# EAGLE design dragon_fractal_pcb (EAGLE 6.1)
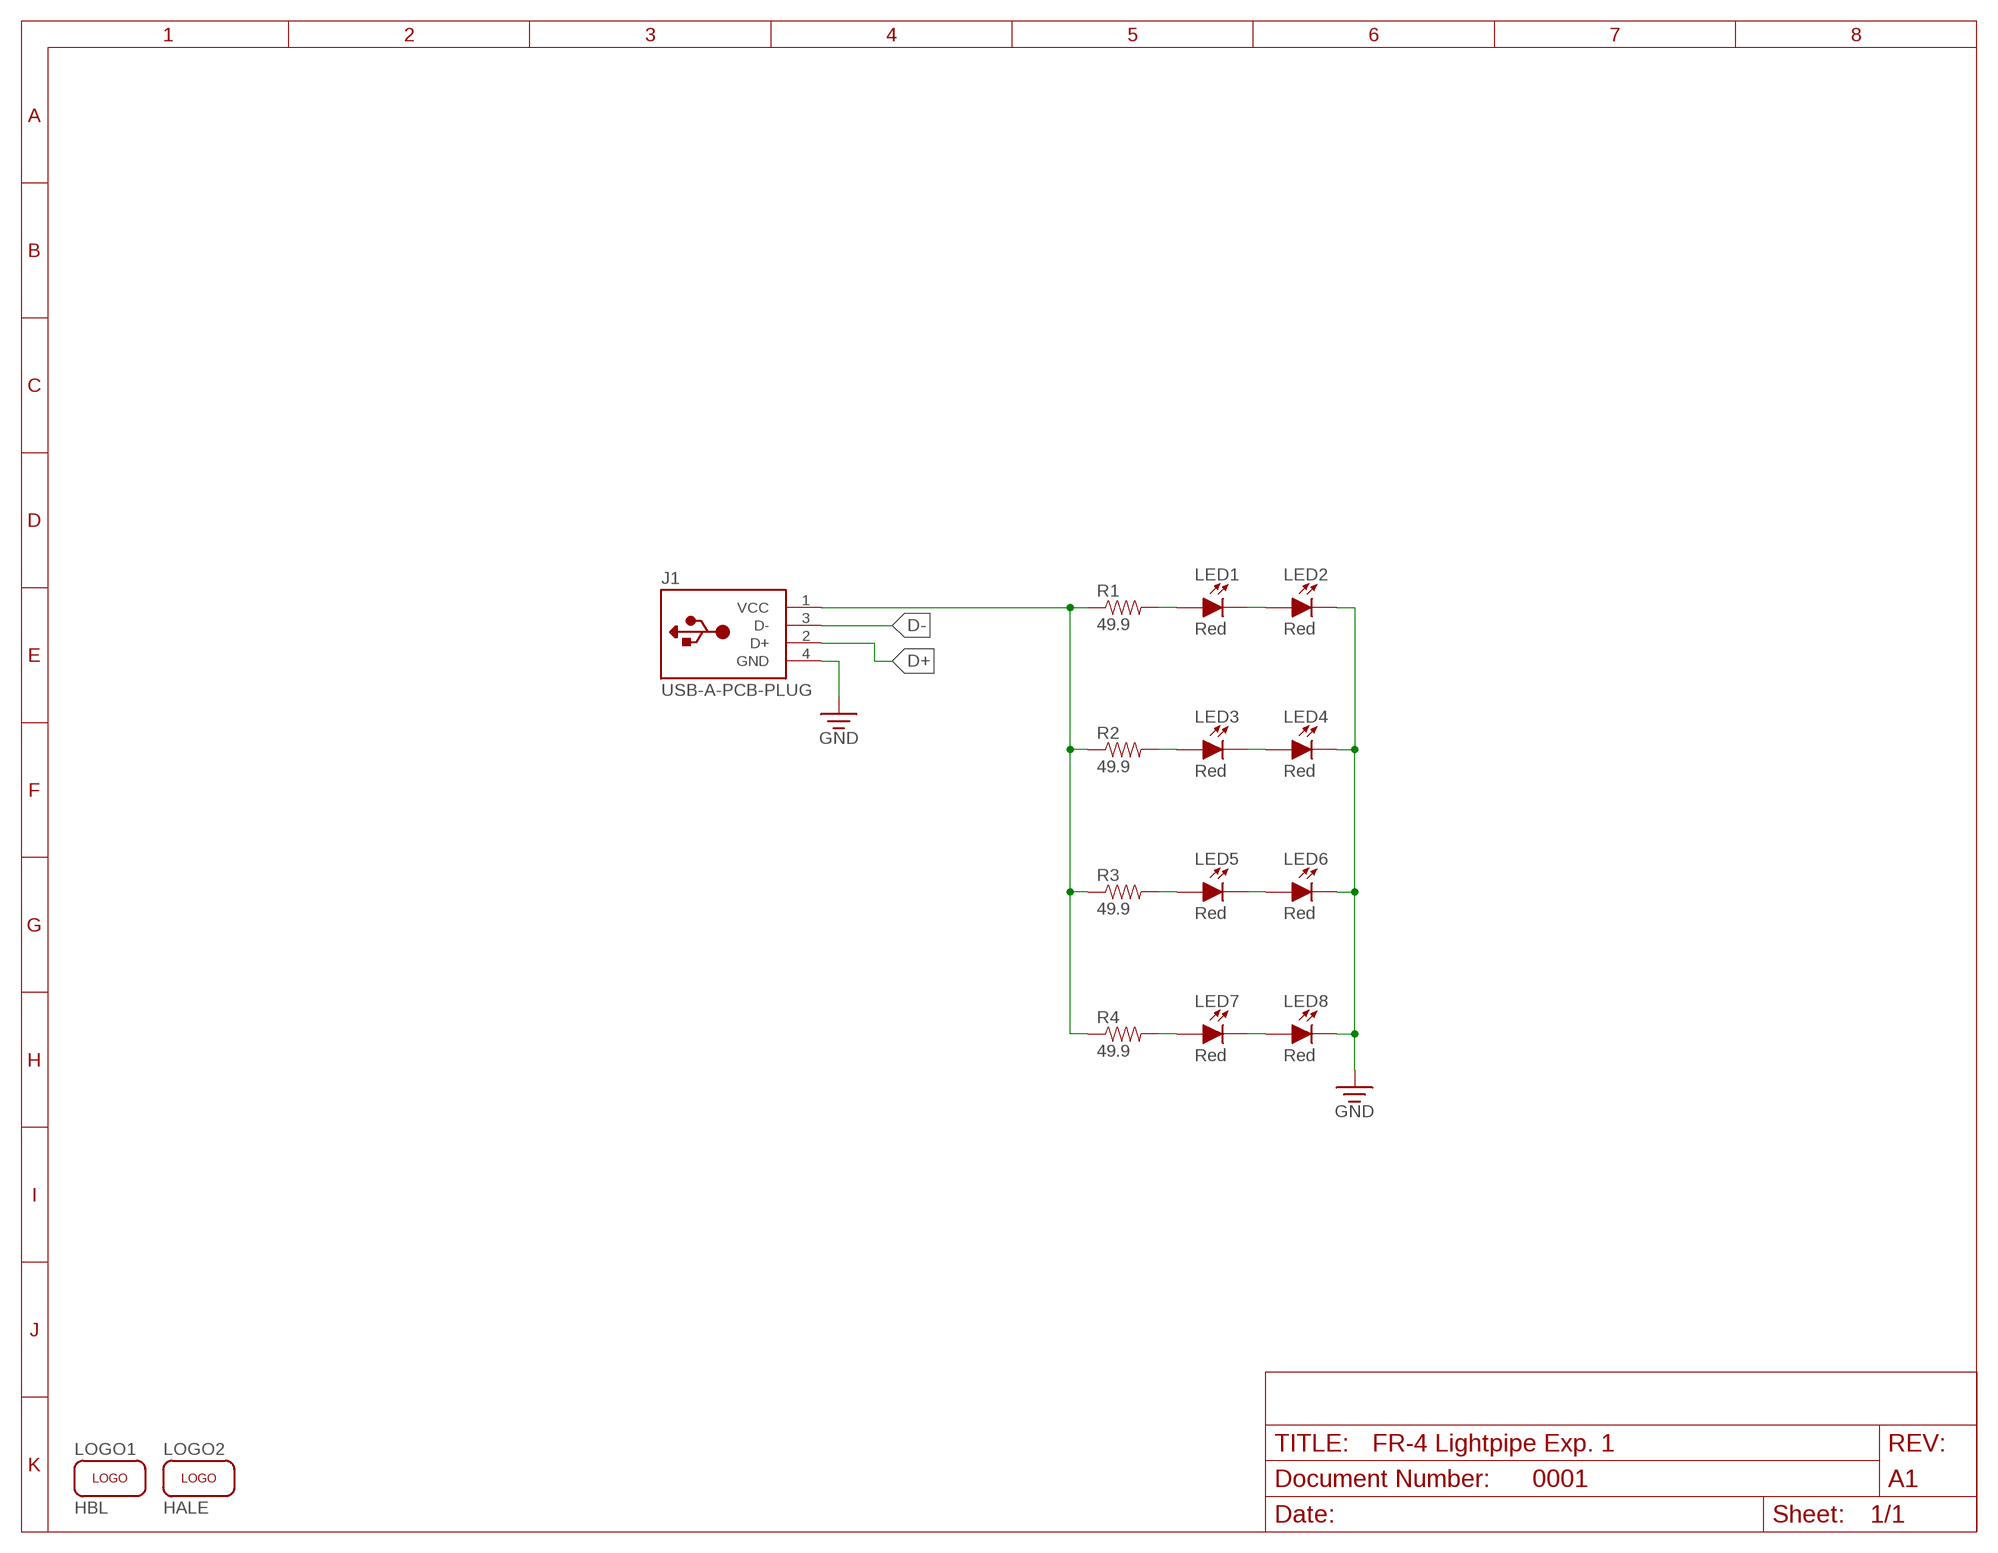
[diagram p0: schematic, sheet 1]

## Parts
J1  USB-A-PCB-PLUG  [USB-A-PLUG-PCB]
LED1  Red  LED-OREO  [LED-TH-OREO]
LED2  Red  LED-OREO  [LED-TH-OREO]
LED3  Red  LED-OREO  [LED-TH-OREO]
LED4  Red  LED-OREO  [LED-TH-OREO]
LED5  Red  LED-OREO  [LED-TH-OREO]
LED6  Red  LED-OREO  [LED-TH-OREO]
LED7  Red  LED-OREO  [LED-TH-OREO]
LED8  Red  LED-OREO  [LED-TH-OREO]
LOGO1  HBL  LOGO-HACKERBOT  [HACKERBOT-SILK-ICON]
LOGO2  HALE  LOGO-HALE  [HALE-SILK-ICON]
R1  49.9  R-0603  [0603-NONPOLAR]
R2  49.9  R-0603  [0603-NONPOLAR]
R3  49.9  R-0603  [0603-NONPOLAR]
R4  49.9  R-0603  [0603-NONPOLAR]
U$1  FRAME-8.5X11-LANDSCAPE-LET  [FRAME-8.5X11-LANDSCAPE]

## Nets
D+ [electrical]: J1.2(D+)
D- [electrical]: J1.3(D-)
GND [electrical]: J1.4(GND) LED2.C(C1) LED4.C(C1) LED6.C(C1) LED8.C(C1)
N$1 [electrical]: J1.1(VCC) R1.1 R2.1 R3.1 R4.1
N$2 [electrical]: LED1.C(C1) LED2.A(A1)
N$3 [electrical]: LED3.C(C1) LED4.A(A1)
N$4 [electrical]: LED5.C(C1) LED6.A(A1)
N$5 [electrical]: LED7.C(C1) LED8.A(A1)
N$6 [electrical]: LED7.A(A1) R4.2
N$7 [electrical]: LED5.A(A1) R3.2
N$8 [electrical]: LED3.A(A1) R2.2
N$9 [electrical]: LED1.A(A1) R1.2

## Library data of the parts
J1 = aaa:USB-A-PCB: PCB Component USB A Plug; NP: NP
LED1-LED8 = aaa:LED: SMD LED; DIGIKEY: 160-1436-1-ND; MFG: Lite-On Inc.; PN: LTST-C190KRKT
LOGO1 LOGO2 = aaa:LOGO
R1-R4 = aaa:R: SMD Resistor; DIGIKEY: P49.9HCT-ND; MFG: Panasonic; PN: ERJ-3EKF49R9V
U$1 = aaa:FRAME-8.5X11-LANDSCAPE; DOCNUM: 0001; REV: A1; TITLE: FR-4 Lightpipe Exp. 1

## Net classes
1 electrical: clearance 0.254 mm

## Board
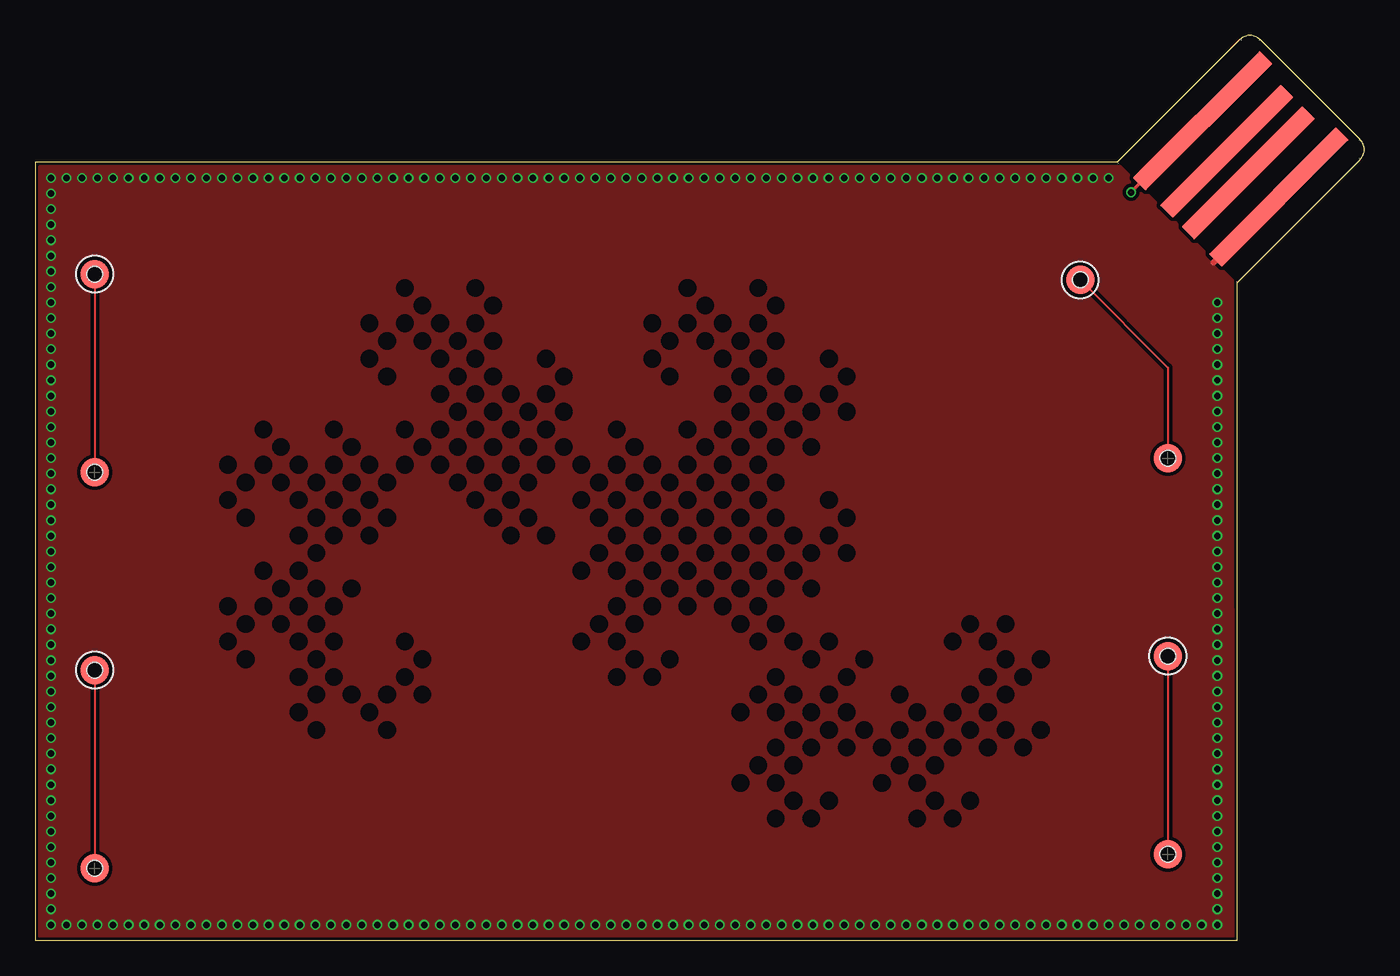
[diagram p1: board, top side]
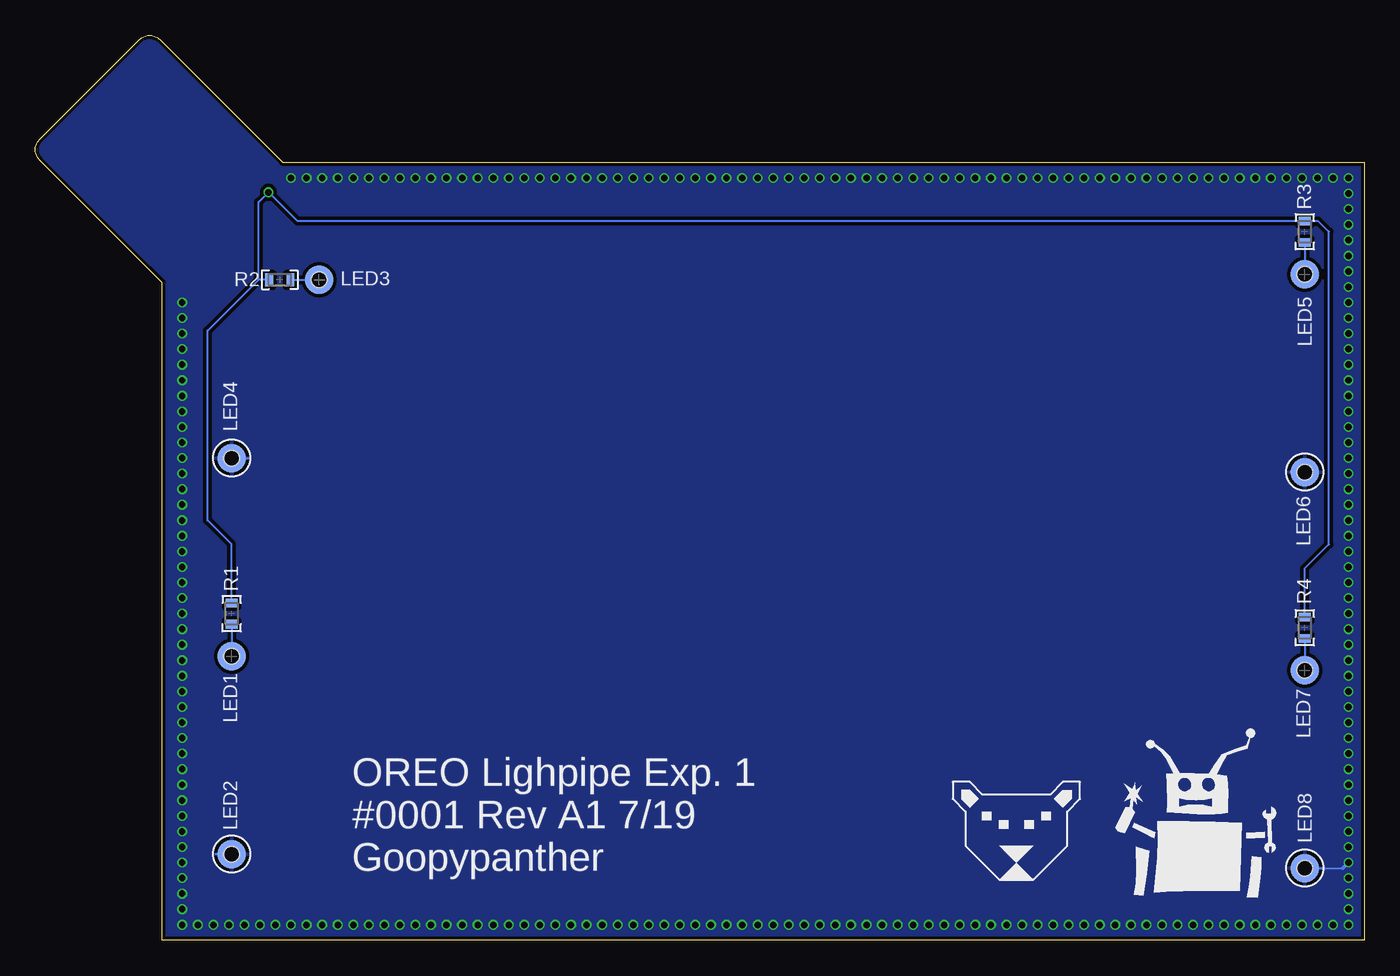
[diagram p2: board, bottom side, seen from below]

Size 93.98 x 63.98 mm. Coordinates in mm from the lower left corner, seen from the top.
Outline: 85,0 85,46.5 93.69,55.19 arc90 93.69,56.61 86.61,63.69 arc90 85.19,63.69 76.5,55 0,55 0,0 85,0
Copper layers (1*16): Top 0.035mm / dielectric 1.5mm / Bottom 0.035mm
Design rules: minimum track width 3.5mil, minimum drill 0.2mm, track to track 3.5mil, track to pad 3.5mil, pad to pad 3.5mil, via to via 5mil, smd to smd 3.5mil, copper to edge 8mil, drill to drill 5mil, minimum pad ring 3mil, minimum via ring 3mil, stop-mask expansion 4mil, vias tented up to drill 0mil, thermal gap 10mil
tRestrict: area 13,20.5 to 14.2,21.7; area 13,23 to 14.2,24.2; area 13,30.5 to 14.2,31.7; area 13,33 to 14.2,34.2; area 14.2,19.2 to 15.5,20.5; area 14.2,21.7 to 15.5,23; area 14.2,29.2 to 15.5,30.5; area 14.2,31.7 to 15.5,33; area 15.5,23 to 16.8,24.2; area 15.5,25.5 to 16.8,26.7; area 15.5,33 to 16.8,34.2; area 15.5,35.5 to 16.8,36.7; area 16.8,34.2 to 18,35.5; area 16.8,31.7 to 18,33; area 16.8,24.2 to 18,25.5; area 16.8,21.7 to 18,23; area 18,33 to 19.3,34.2; area 18,30.5 to 19.3,31.7; area 18,28 to 19.3,29.2; area 18,25.5 to 19.3,26.7; area 18,23 to 19.3,24.2; area 18,20.5 to 19.3,21.7; area 18,18 to 19.3,19.2; area 18,15.5 to 19.3,16.7; area 19.3,31.7 to 20.5,33; area 19.3,29.2 to 20.5,30.5; area 19.3,26.7 to 20.5,28; area 19.3,24.2 to 20.5,25.5; area 19.3,21.7 to 20.5,23; area 19.3,19.2 to 20.5,20.5; area 19.3,16.7 to 20.5,18; area 19.3,14.2 to 20.5,15.5; area 20.5,33 to 21.8,34.2; area 20.5,35.5 to 21.8,36.7; area 20.5,30.5 to 21.8,31.7; area 20.5,28 to 21.8,29.2; area 20.5,23 to 21.8,24.2; area 20.5,20.5 to 21.8,21.7; area 20.5,18 to 21.8,19.2; area 21.8,34.2 to 23,35.5; area 21.8,31.7 to 23,33; area 21.8,29.2 to 23,30.5; area 21.8,24.2 to 23,25.5; area 21.8,16.7 to 23,18; area 23,33 to 24.3,34.2; area 23,30.5 to 24.3,31.7; area 23,28 to 24.3,29.2; area 23,15.5 to 24.3,16.7; area 23,40.5 to 24.3,41.7; area 23,43 to 24.3,44.2; area 24.3,41.7 to 25.5,43; area 24.3,39.2 to 25.5,40.5; area 24.3,31.7 to 25.5,33; area 24.3,29.2 to 25.5,30.5; area 24.3,16.7 to 25.5,18; area 24.3,14.2 to 25.5,15.5; area 25.5,43 to 26.8,44.2; area 25.5,45.5 to 26.8,46.7; area 25.5,33 to 26.8,34.2; area 25.5,35.5 to 26.8,36.7; area 25.5,18 to 26.8,19.2; area 25.5,20.5 to 26.8,21.7; area 26.8,44.2 to 28,45.5; area 26.8,41.7 to 28,43; area 26.8,34.2 to 28,35.5; area 26.8,19.2 to 28,20.5; area 26.8,16.7 to 28,18; area 28,43 to 29.3,44.2; area 28,40.5 to 29.3,41.7; area 28,38 to 29.3,39.2; area 28,35.5 to 29.3,36.7; area 28,33 to 29.3,34.2; area 29.3,41.7 to 30.5,43; area 29.3,39.2 to 30.5,40.5; area 29.3,36.7 to 30.5,38; area 29.3,34.2 to 30.5,35.5; area 29.3,31.7 to 30.5,33; area 30.5,40.5 to 31.8,41.7; area 30.5,43 to 31.8,44.2; area 30.5,45.5 to 31.8,46.7; area 30.5,38 to 31.8,39.2; area 30.5,35.5 to 31.8,36.7; area 30.5,33 to 31.8,34.2; area 30.5,30.5 to 31.8,31.7; area 31.8,44.2 to 33,45.5; area 31.8,41.7 to 33,43; area 31.8,39.2 to 33,40.5; area 31.8,36.7 to 33,38; area 31.8,34.2 to 33,35.5; area 31.8,31.7 to 33,33; area 31.8,29.2 to 33,30.5; area 33,28 to 34.3,29.2; area 33,30.5 to 34.3,31.7; area 33,33 to 34.3,34.2; area 33,35.5 to 34.3,36.7; area 33,38 to 34.3,39.2; area 34.3,29.2 to 35.5,30.5; area 34.3,31.7 to 35.5,33; area 34.3,34.2 to 35.5,35.5; area 34.3,36.7 to 35.5,38; area 35.5,28 to 36.8,29.2; area 35.5,33 to 36.8,34.2; area 35.5,35.5 to 36.8,36.7; area 35.5,38 to 36.8,39.2; area 35.5,40.5 to 36.8,41.7; area 36.8,39.2 to 38,40.5; area 36.8,36.7 to 38,38; area 36.8,34.2 to 38,35.5; area 38,33 to 39.3,34.2; area 38,30.5 to 39.3,31.7; area 38,25.5 to 39.3,26.7; area 38,20.5 to 39.3,21.7; area 39.3,31.7 to 40.5,33; area 39.3,29.2 to 40.5,30.5; area 39.3,26.7 to 40.5,28; area 40.5,25.5 to 41.8,26.7; area 40.5,28 to 41.8,29.2; area 40.5,30.5 to 41.8,31.7; area 40.5,33 to 41.8,34.2; area 41.8,31.7 to 43,33; area 41.8,29.2 to 43,30.5; area 41.8,26.7 to 43,28; area 43,25.5 to 44.3,26.7; area 43,28 to 44.3,29.2; area 43,30.5 to 44.3,31.7; area 43,33 to 44.3,34.2; area 44.3,31.7 to 45.5,33; area 44.3,29.2 to 45.5,30.5; area 44.3,26.7 to 45.5,28; area 45.5,25.5 to 46.8,26.7; area 45.5,28 to 46.8,29.2; area 45.5,30.5 to 46.8,31.7; area 45.5,33 to 46.8,34.2; area 46.8,31.7 to 48,33; area 46.8,29.2 to 48,30.5; area 46.8,26.7 to 48,28; area 48,25.5 to 49.3,26.7; area 48,28 to 49.3,29.2; area 48,30.5 to 49.3,31.7; area 48,33 to 49.3,34.2; area 49.3,31.7 to 50.5,33; area 49.3,29.2 to 50.5,30.5; area 49.3,26.7 to 50.5,28; area 50.5,25.5 to 51.8,26.7; area 50.5,28 to 51.8,29.2; area 50.5,30.5 to 51.8,31.7; area 50.5,33 to 51.8,34.2; area 51.8,31.7 to 53,33; area 51.8,29.2 to 53,30.5; area 51.8,26.7 to 53,28; area 39.3,21.7 to 40.5,23; area 40.5,35.5 to 41.8,36.7; area 41.8,34.2 to 43,35.5; area 41.8,24.2 to 43,25.5; area 40.5,23 to 41.8,24.2; area 41.8,21.7 to 43,23; area 40.5,20.5 to 41.8,21.7; area 41.8,19.2 to 43,20.5; area 40.5,18 to 41.8,19.2; area 43,18 to 44.3,19.2; area 44.3,24.2 to 45.5,25.5; area 43,23 to 44.3,24.2; area 45.5,23 to 46.8,24.2; area 45.5,35.5 to 46.8,36.7; area 44.3,39.2 to 45.5,40.5; area 43,40.5 to 44.3,41.7; area 44.3,41.7 to 45.5,43; area 43,43 to 44.3,44.2; area 45.5,43 to 46.8,44.2; area 46.8,44.2 to 48,45.5; area 45.5,45.5 to 46.8,46.7; area 46.8,41.7 to 48,43; area 48,43 to 49.3,44.2; area 44.3,19.2 to 45.5,20.5; area 46.8,34.2 to 48,35.5; area 46.8,24.2 to 48,25.5; area 48,40.5 to 49.3,41.7; area 48,38 to 49.3,39.2; area 48,35.5 to 49.3,36.7; area 48,23 to 49.3,24.2; area 49.3,41.7 to 50.5,43; area 49.3,39.2 to 50.5,40.5; area 49.3,36.7 to 50.5,38; area 49.3,34.2 to 50.5,35.5; area 49.3,24.2 to 50.5,25.5; area 49.3,21.7 to 50.5,23; area 49.3,15.5 to 50.5,16.7; area 49.3,10.5 to 50.5,11.8; area 50.5,45.5 to 51.8,46.7; area 50.5,43 to 51.8,44.2; area 50.5,40.5 to 51.8,41.7; area 50.5,38 to 51.8,39.2; area 50.5,35.5 to 51.8,36.7; area 50.5,23 to 51.8,24.2; area 50.5,20.5 to 51.8,21.7; area 50.5,16.7 to 51.8,18; area 50.5,11.8 to 51.8,13; area 51.8,44.2 to 53,45.5; area 51.8,41.7 to 53,43; area 51.8,39.2 to 53,40.5; area 51.8,36.7 to 53,38; area 51.8,34.2 to 53,35.5; area 51.8,24.2 to 53,25.5; area 51.8,21.7 to 53,23; area 51.8,18 to 53,19.2; area 51.8,15.5 to 53,16.7; area 51.8,13 to 53,14.2; area 51.8,10.5 to 53,11.8; area 51.8,8 to 53,9.2; area 53,38 to 54.3,39.2; area 53,35.5 to 54.3,36.7; area 53,28 to 54.3,29.2; area 53,25.5 to 54.3,26.7; area 53,20.5 to 54.3,21.7; area 53,16.7 to 54.3,18; area 53,14.2 to 54.3,15.5; area 53,11.8 to 54.3,13; area 53,9.2 to 54.3,10.5; area 54.3,36.7 to 55.5,38; area 54.3,34.2 to 55.5,35.5; area 54.3,26.7 to 55.5,28; area 54.3,24.2 to 55.5,25.5; area 54.3,19.2 to 55.5,20.5; area 54.3,15.5 to 55.5,16.7; area 54.3,13 to 55.5,14.2; area 54.3,8 to 55.5,9.2; area 55.5,38 to 56.8,39.2; area 55.5,40.5 to 56.8,41.7; area 55.5,28 to 56.8,29.2; area 55.5,30.5 to 56.8,31.7; area 55.5,20.5 to 56.8,21.7; area 55.5,14.2 to 56.8,15.5; area 55.5,9.2 to 56.8,10.5; area 56.8,39.2 to 58,40.5; area 56.8,36.7 to 58,38; area 56.8,29.2 to 58,30.5; area 56.8,26.7 to 58,28; area 55.5,16.7 to 56.8,18; area 56.8,18 to 58,19.2; area 56.8,15.5 to 58,16.7; area 56.8,13 to 58,14.2; area 58,19.2 to 59.3,20.5; area 58,14.2 to 59.3,15.5; area 59.3,13 to 60.5,14.2; area 59.3,10.5 to 60.5,11.8; area 60.5,11.8 to 61.8,13; area 60.5,14.2 to 61.8,15.5; area 60.5,16.7 to 61.8,18; area 61.8,15.5 to 63,16.7; area 61.8,13 to 63,14.2; area 61.8,10.5 to 63,11.8; area 61.8,8 to 63,9.2; area 63,14.2 to 64.2,15.5; area 63,11.8 to 64.2,13; area 63,9.2 to 64.2,10.5; area 64.2,8 to 65.5,9.2; area 65.5,9.2 to 66.8,10.5; area 64.2,13 to 65.5,14.2; area 64.2,15.5 to 65.5,16.7; area 64.2,20.5 to 65.5,21.7; area 65.5,14.2 to 66.8,15.5; area 65.5,16.7 to 66.8,18; area 65.5,21.7 to 66.8,23; area 66.8,20.5 to 68,21.7; area 66.8,18 to 68,19.2; area 66.8,15.5 to 68,16.7; area 66.8,13 to 68,14.2; area 68,21.7 to 69.2,23; area 68,19.2 to 69.2,20.5; area 68,16.7 to 69.2,18; area 68,14.2 to 69.2,15.5; area 69.2,18 to 70.5,19.2; area 70.5,19.2 to 71.8,20.5; area 69.2,13 to 70.5,14.2; area 70.5,14.2 to 71.8,15.5

### Footprints (pad centres in the part's own frame; a part is rotated, then mirrored left to right if it is on the bottom)
USB-A-PLUG-PCB = smd 1.27 x 12.7: 1 -3.81,6.35; 4 3.81,6.35 | smd 1.27 x 12.065: 2 -1.079,6.032; 3 1.079,6.032
LED-TH-OREO = smd 2 x 2: A 0,0 | smd 2 x 2 bottom: C 0,0 | hole 1.1: 0,0
0603-NONPOLAR = smd 0.6 x 0.9: 1 -0.75,0; 2 0.75,0

### Placement (x,y rotation side)
DRILEGEND  [DRILEGEND]  -22.42,159.07 0 top  (outside the outline)
J1  80.76,50.76 315 top
LED1  80.1,20.1 0 bottom
LED2  80.1,6.1 0 top
LED3  73.9,46.7 0 bottom
LED4  80.1,34.1 0 top
LED5  4.2,47.1 0 bottom
LED6  4.2,33.1 0 top
LED7  4.2,19.1 0 bottom
LED8  4.2,5.1 0 top
LOGO1  11.7,6.1 0 bottom
LOGO2  24.6,5.5 0 bottom
R1  80.1,23.1 270 bottom
R2  76.7,46.7 0 bottom
R3  4.2,50.1 270 bottom
R4  4.2,22.1 270 bottom
U$1  -46.4,-48.1 0 top  (outside the outline)

### Tracks (layer width: path | path; a pad name or v marks a point on that pad's centre or on a via)
GND  (via drill 0.46 pad 0.64)
  Top 0.406: J1.4 83.3,47.91 83.3,47.9
  Bottom 0.127: LED8.C 1.5,5.1 | LED6.C 5.2,33.1 | LED2.C 81.2,6.1 | LED4.C 78.9,34.1
  Bottom 0.254: 1.5,5.1 v1.1,5.5
  other vias: 1.1,53.9 1.1,52.8 1.1,51.7 1.1,50.6 1.1,49.5 1.1,48.4 1.1,47.3 1.1,46.2 1.1,45.1 1.1,44 1.1,42.9 1.1,41.8 1.1,40.7 1.1,39.6 1.1,38.5 1.1,37.4 1.1,36.3 1.1,35.2 1.1,34.1 1.1,33 1.1,31.9 1.1,30.8 1.1,29.7 1.1,28.6 1.1,27.5 1.1,26.4 1.1,25.3 1.1,24.2 1.1,23.1 1.1,22 1.1,20.9 1.1,19.8 1.1,18.7 1.1,17.6 1.1,16.5 1.1,15.4 1.1,14.3 1.1,13.2 1.1,12.1 1.1,11 1.1,9.9 1.1,8.8 1.1,7.7 1.1,6.6 1.1,4.4 1.1,3.3 1.1,2.2 1.1,1.1 2.2,53.9 3.3,53.9 4.4,53.9 5.5,53.9 6.6,53.9 7.7,53.9 8.8,53.9 9.9,53.9 11,53.9 12.1,53.9 13.2,53.9 14.3,53.9 15.4,53.9 16.5,53.9 17.6,53.9 18.7,53.9 19.8,53.9 20.9,53.9 22,53.9 23.1,53.9 24.2,53.9 25.3,53.9 26.4,53.9 27.5,53.9 28.6,53.9 29.7,53.9 30.8,53.9 31.9,53.9 33,53.9 34.1,53.9 35.2,53.9 36.3,53.9 37.4,53.9 38.5,53.9 39.6,53.9 40.7,53.9 41.8,53.9 42.9,53.9 44,53.9 45.1,53.9 46.2,53.9 47.3,53.9 48.4,53.9 49.5,53.9 50.6,53.9 51.7,53.9 52.8,53.9 53.9,53.9 2.2,1.1 3.3,1.1 4.4,1.1 5.5,1.1 6.6,1.1 7.7,1.1 8.8,1.1 9.9,1.1 11,1.1 12.1,1.1 13.2,1.1 14.3,1.1 15.4,1.1 16.5,1.1 17.6,1.1 18.7,1.1 19.8,1.1 20.9,1.1 22,1.1 23.1,1.1 24.2,1.1 25.3,1.1 26.4,1.1 27.5,1.1 28.6,1.1 29.7,1.1 30.8,1.1 31.9,1.1 33,1.1 34.1,1.1 35.2,1.1 36.3,1.1 37.4,1.1 38.5,1.1 39.6,1.1 40.7,1.1 41.8,1.1 42.9,1.1 44,1.1 45.1,1.1 46.2,1.1 47.3,1.1 48.4,1.1 49.5,1.1 50.6,1.1 51.7,1.1 52.8,1.1 53.9,1.1 83.6,1.1 82.5,1.1 81.4,1.1 80.3,1.1 79.2,1.1 78.1,1.1 77,1.1 75.9,1.1 74.8,1.1 73.7,1.1 72.6,1.1 71.5,1.1 70.4,1.1 69.3,1.1 68.2,1.1 67.1,1.1 66,1.1 64.9,1.1 63.8,1.1 62.7,1.1 61.6,1.1 60.5,1.1 59.4,1.1 58.3,1.1 57.2,1.1 56.1,1.1 55,1.1 75.9,53.9 74.8,53.9 73.7,53.9 72.6,53.9 71.5,53.9 70.4,53.9 69.3,53.9 68.2,53.9 67.1,53.9 66,53.9 64.9,53.9 63.8,53.9 62.7,53.9 61.6,53.9 60.5,53.9 59.4,53.9 58.3,53.9 57.2,53.9 56.1,53.9 55,53.9 83.6,45.1 83.6,44 83.6,42.9 83.6,41.8 83.6,40.7 83.6,39.6 83.6,38.5 83.6,37.4 83.6,36.3 83.6,35.2 83.6,34.1 83.6,33 83.6,31.9 83.6,30.8 83.6,29.7 83.6,28.6 83.6,27.5 83.6,26.4 83.6,25.3 83.6,24.2 83.6,23.1 83.6,22 83.6,20.9 83.6,19.8 83.6,18.7 83.6,17.6 83.6,16.5 83.6,15.4 83.6,14.3 83.6,13.2 83.6,12.1 83.6,11 83.6,9.9 83.6,8.8 83.6,7.7 83.6,6.6 83.6,5.5 83.6,4.4 83.6,3.3 83.6,2.2
  pour Bottom (isolate 0.254): 0.3,0.3 84.7,0.3 84.67,46.65 93.5,55.38 arc90 93.5,56.4 86.4,63.5 arc90 85.4,63.5 76.65,54.68 0.3,54.7
  pour Top: 0.3,0.3 84.7,0.3 84.67,46.65 76.75,54.68 0.3,54.7
N$1  (1 unrouted)
  Top 0.254: J1.1 77.5,52.89
  Bottom 0.127: R1.1 80.1,28 81.8,29.7 81.8,43.1 78.2,46.7 | R4.1 4.2,26.3 2.5,28 2.5,50.1 3.25,50.85 R3.1 75.45,50.85 77.5,52.9 78.2,52.2 78.2,46.7 | R2.1 78.2,46.7
N$2
  Top 0.127: LED1.C LED2.A
N$3
  Top 0.127: LED3.C 80.1,40.5 LED4.A
N$4
  Top 0.127: LED5.C LED6.A
N$5
  Top 0.127: LED7.C LED8.A
N$6
  Bottom 0.127: R4.2 LED7.A
N$7
  Bottom 0.127: R3.2 LED5.A
N$8
  Bottom 0.127: R2.2 LED3.A
N$9
  Bottom 0.127: R1.2 LED1.A
N$10  (via drill 0.46 pad 0.64)
  other vias: 77.5,52.89

### Text on the board
Document: Notes: | 1. | Top/component side shown. | Dimension in MM unless otherwise specified. | 2. | Fabricate PCB in accordance with IPC-6012 Class 2. | 3. | Registration: Hole position shall be within 0.2032mm | (8mil) of true position. | 4. | All holes shall have a tolerance of +/-0.08mm (3.15mil). | 0.46mm (18mil) holes marked with + in drill diagram and | listed in PTH.XLN excellon file shall be plated (PTH). | 1.1mm (43.3mil) holes marked with x in drill diagram and | listed in NPTH.XLN excellon file shall not be plated (NPTH). | 5. | Material: FR-4 laminate and prepreg per IPC-4101/21. | 0.035mm (1oz) (1.38mil) copper exterior layers. | Board thickness shall be 1.5748mm (62mil) +/-0.254mm (10mil). | 6. | Finish: All exposed conductive pattern areas shall be | plated by HASL. | Apply solder mask (matte black) per IPC-SM-840 Class T | to both sides over bare copper. | Via holes shall not be plugged. | 7. | Silkscreen: White, both sides per MIL-I-43553. | Not to be printed on exposed conductive pattern areas. | Manufacturer identification codes shall not be printed on | top layer of PCB. | # | Name | File | Notes | 1 | Top Stencil | .GTP | 2 | Top Silk | .GTO | 3 | Top Solder Mask | .GTS | 4 | Top Layer | .GTL | 5 | Bottom Layer | .GBL | 6 | Bottom Solder Mask | .GBS | 7 | Bottom Silk | .GBO | 8 | Bottom Stencil | .GBP | 9 | Board Outline | .GKO | 10 | Plated Drills | .PTH.XLN | 11 | Unplated Drills | .NPTH.XLN | 12 | Drill Drawing | .GD1 | 13 | Documentation | .GD2
bSilk: OREO Lighpipe Exp. 1 | #0001 Rev A1 7/19 | Goopypanther
DrillLegend: LAYER-STACK
DrillLegend_01-16: 01-16
DrillLegend_01-20: 01-20